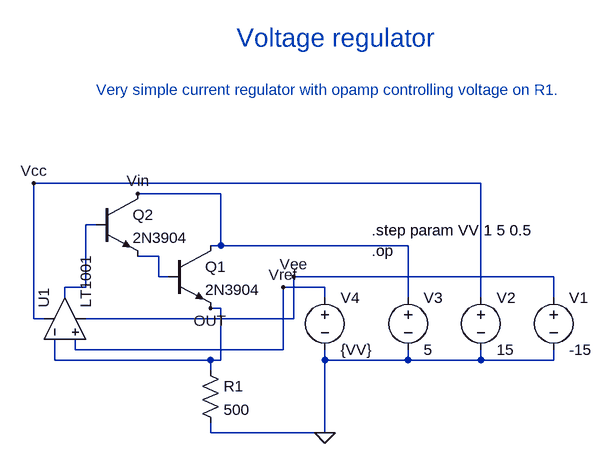
[diagram p0: schematic Voltage-regulator-npn.asc]
Voltage-regulator-npn.asc, the LTspice schematic file:
Version 4.1
SHEET 1 1056 680
WIRE 160 464 160 480
WIRE 688 352 688 368
WIRE 576 352 576 368
WIRE 464 352 464 368
WIRE 336 352 336 368
WIRE 160 480 336 480
WIRE 336 480 336 368
WIRE 336 368 464 368
WIRE 464 368 576 368
WIRE 576 368 688 368
FLAG 336 480 0
WIRE -16 160 -32 160
WIRE -64 272 -64 256
WIRE -32 160 -32 256
WIRE -32 256 -64 256
WIRE 96 240 80 240
WIRE 48 208 64 208
WIRE 80 240 80 208
WIRE 80 208 64 208
WIRE 160 288 176 288
WIRE 160 384 160 368
WIRE -80 336 -80 352
WIRE 176 288 176 368
WIRE 176 368 160 368
WIRE 160 368 -80 368
WIRE -80 368 -80 352
FLAG 160 288 OUT
WIRE -96 304 -112 304
WIRE 576 272 576 256
WIRE -112 304 -112 96
WIRE -112 96 576 96
WIRE 576 96 576 256
FLAG -112 96 Vcc
WIRE -32 304 -16 304
WIRE 688 272 688 256
WIRE -16 304 288 304
WIRE 288 304 288 240
WIRE 288 240 688 240
WIRE 688 240 688 256
FLAG 288 240 Vee
WIRE 160 192 176 192
WIRE 48 112 64 112
WIRE 464 272 464 256
WIRE 176 192 176 112
WIRE 176 112 64 112
WIRE 176 192 464 192
WIRE 464 192 464 256
FLAG 48 112 Vin
WIRE -48 336 -48 352
WIRE 336 272 336 256
WIRE -48 352 272 352
WIRE 272 352 272 256
WIRE 272 256 336 256
FLAG 272 256 Vref
SYMBOL npn 96 192 R0
SYMATTR InstName Q1
SYMATTR Value 2N3904
SYMBOL npn -16 112 R0
SYMATTR InstName Q2
SYMATTR Value 2N3904
SYMBOL Opamps\\LT1001 -128 304 R270
SYMATTR InstName U1
SYMBOL voltage 688 256 R0
WINDOW 123 0 0 Left 2
WINDOW 39 0 0 Left 2
SYMATTR InstName V1
SYMATTR Value -15
SYMBOL voltage 576 256 R0
WINDOW 123 0 0 Left 2
WINDOW 39 0 0 Left 2
SYMATTR InstName V2
SYMATTR Value 15
SYMBOL voltage 464 256 R0
WINDOW 123 0 0 Left 2
WINDOW 39 0 0 Left 2
SYMATTR InstName V3
SYMATTR Value 5
SYMBOL res 144 368 R0
SYMATTR InstName R1
SYMATTR Value 500
SYMBOL voltage 336 256 R0
WINDOW 123 0 0 Left 2
WINDOW 39 0 0 Left 2
SYMATTR InstName V4
SYMATTR Value {VV}
TEXT 408 168 Left 2 !.step param VV 1 5 0.5
TEXT 408 200 Left 2 !.op
TEXT -16 -48 Left 2 ;Very simple current regulator with opamp controlling voltage on R1.
TEXT 200 -128 Left 4 ;Voltage regulator

The netlist it stands for:
* Voltage-regulator-npn.asc
Q1 Vin N002 OUT 0 2N3904
Q2 Vin N001 N002 0 2N3904
X§U1 Vref OUT Vcc Vee N001 LT1001  ; pins In+ In- V+ V- OUT
V1 Vee 0 -15
V2 Vcc 0 15
V3 Vin 0 5
R1 OUT 0 500
V4 Vref 0 {VV}
.model NPN NPN
.model PNP PNP
.lib standard.bjt
.step param VV 1 5 0.5
.op
* Very simple current regulator with opamp controlling voltage on R1.
* Voltage regulator
.lib LTC.lib
.backanno
.end